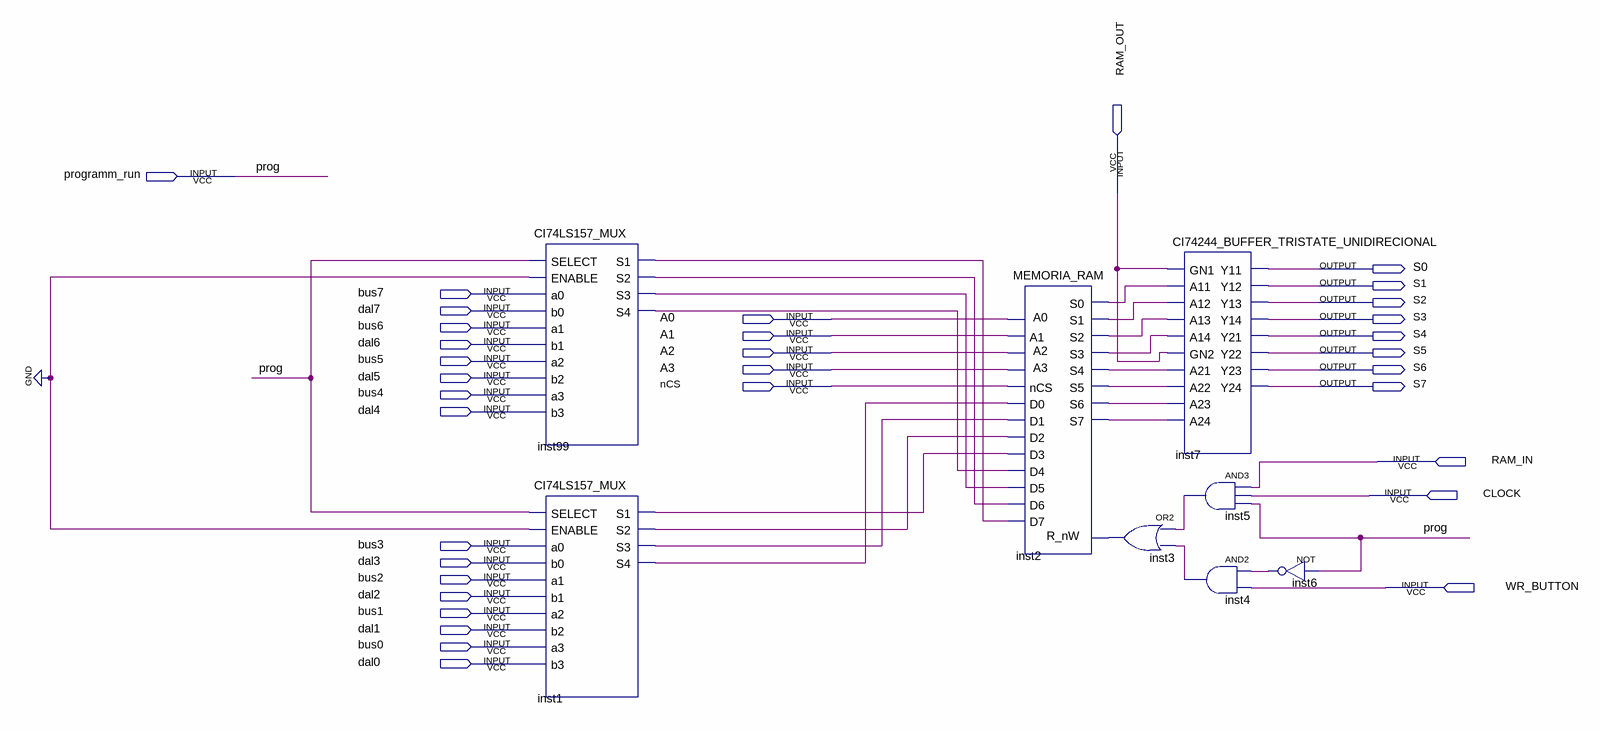
[diagram p0: schematic sheet]
// Quartus schematic MEMORIA_RAM_COMPLETA.bdf as structural Verilog: 8 symbols, 34 pins
module MEMORIA_RAM_COMPLETA (
  input  programm_run,
  input  RAM_OUT,
  input  bus7,
  input  dal7,
  input  A0,
  input  bus6,
  input  A1,
  input  dal6,
  input  A2,
  input  bus5,
  input  A3,
  input  dal5,
  input  nCS,
  input  bus4,
  input  dal4,
  input  RAM_IN,
  input  CLOCK,
  input  bus3,
  input  dal3,
  input  bus2,
  input  WR_BUTTON,
  input  dal2,
  input  bus1,
  input  dal1,
  input  bus0,
  input  dal0,
  output S0,
  output S1,
  output S2,
  output S3,
  output S4,
  output S5,
  output S6,
  output S7
);

  wire inst1_s1, inst1_s2, inst1_s3, inst1_s4, inst2_s0, inst2_s1, inst2_s2, inst2_s3, inst2_s4, inst2_s5,
       inst2_s6, inst2_s7, inst3_out, inst4_out, inst5_out, inst6_out, inst99_s1, inst99_s2, inst99_s3,
       inst99_s4;

  CI74LS157_MUX inst99 (
    .SELECT(programm_run), .ENABLE(1'b0), .a0(bus7), .b0(dal7), .a1(bus6), .b1(dal6), .a2(bus5), .b2(dal5),
    .a3(bus4), .b3(dal4), .S1(inst99_s1), .S2(inst99_s2), .S3(inst99_s3), .S4(inst99_s4));
  CI74LS157_MUX inst1 (
    .SELECT(programm_run), .ENABLE(1'b0), .a0(bus3), .b0(dal3), .a1(bus2), .b1(dal2), .a2(bus1), .b2(dal1),
    .a3(bus0), .b3(dal0), .S1(inst1_s1), .S2(inst1_s2), .S3(inst1_s3), .S4(inst1_s4));
  MEMORIA_RAM inst2 (
    .R_nW(inst3_out), .A3(A3), .A2(A2), .A1(A1), .A0(A0), .nCS(nCS), .D0(inst1_s4), .D1(inst1_s3),
    .D2(inst1_s2), .D3(inst1_s1), .D4(inst99_s4), .D5(inst99_s3), .D6(inst99_s2), .D7(inst99_s1),
    .S0(inst2_s0), .S1(inst2_s1), .S2(inst2_s2), .S3(inst2_s3), .S4(inst2_s4), .S5(inst2_s5), .S6(inst2_s6),
    .S7(inst2_s7));
  or inst3 (inst3_out, inst5_out, inst4_out);
  CI74244_BUFFER_TRISTATE_UNIDIRECIONAL inst7 (
    .GN1(RAM_OUT), .A11(inst2_s0), .A12(inst2_s1), .A13(inst2_s2), .A14(inst2_s3), .GN2(RAM_OUT),
    .A21(inst2_s4), .A22(inst2_s5), .A23(inst2_s6), .A24(inst2_s7), .Y11(S0), .Y12(S1), .Y13(S2), .Y14(S3),
    .Y21(S4), .Y22(S5), .Y23(S6), .Y24(S7));
  and inst5 (inst5_out, RAM_IN, CLOCK, programm_run);
  and inst4 (inst4_out, inst6_out, WR_BUTTON);
  not inst6 (inst6_out, programm_run);

  // Other names for the same wires on the sheet: prog = programm_run
endmodule
